# Altium project LeVentilateur.PrjPcb (part 1 of 4)
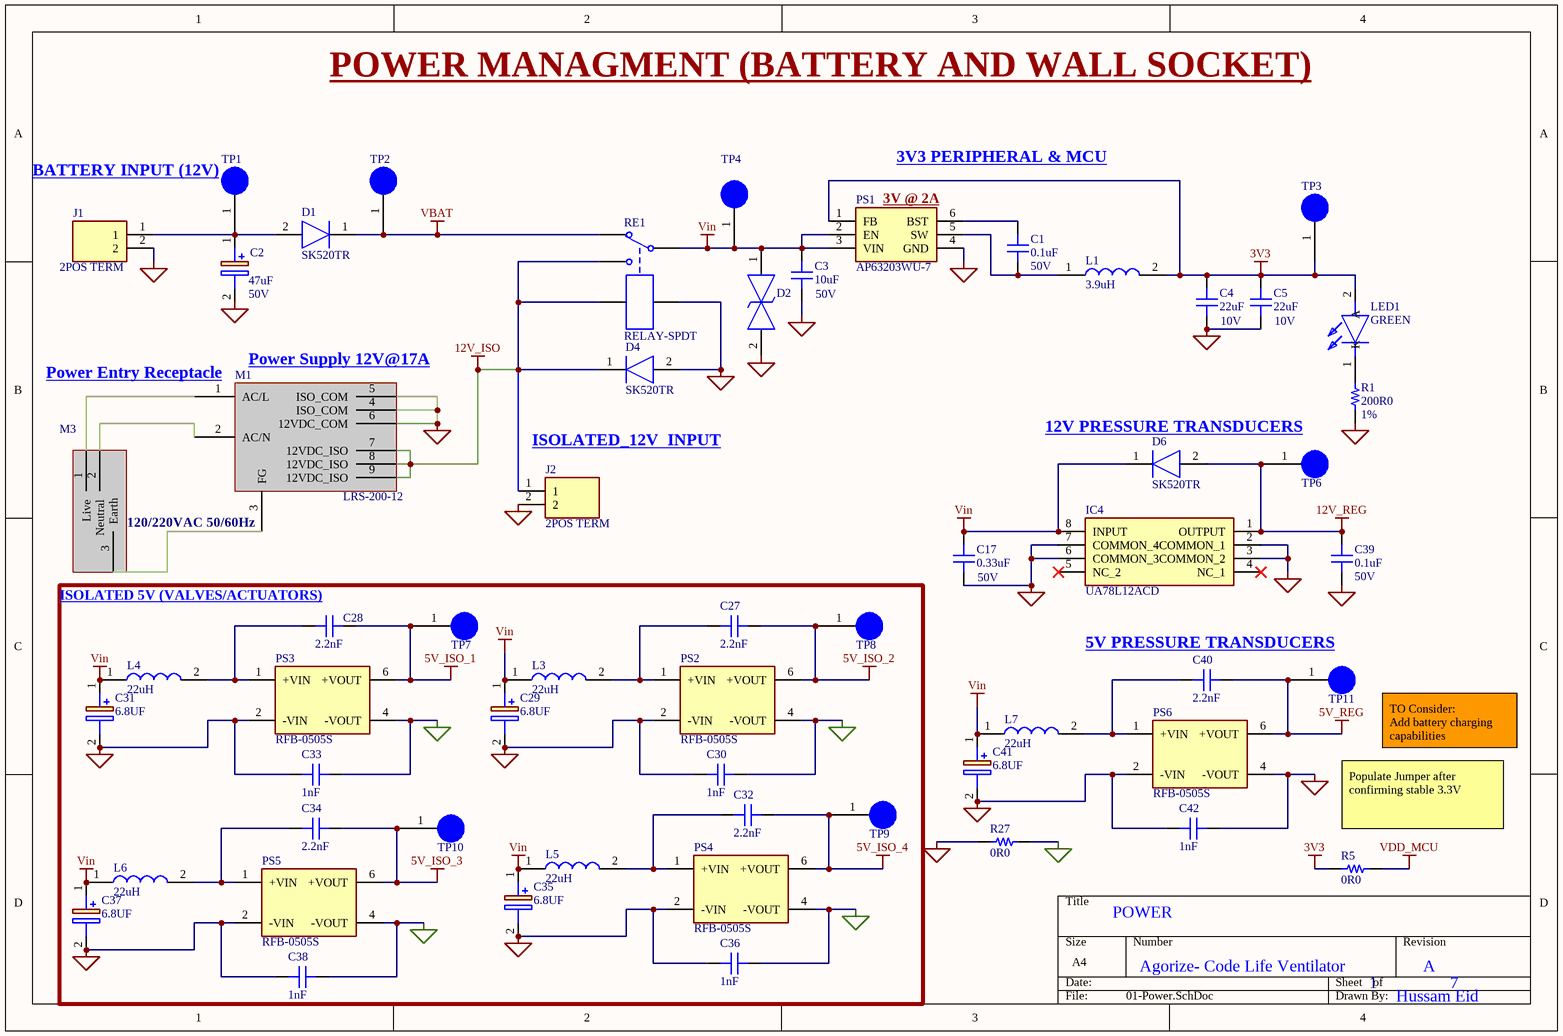
[diagram p0: 01-Power.SchDoc]
Drawn By:: Hussam Eid
7 sheets, 215 parts. Net scope: flat (ports and power ports of the same name join across sheets).
Board file: LeVentilateur.PcbDoc
Sheets:
  01-Power.SchDoc
  02-MCU.SchDoc
  03-Actuators.SchDoc
  04-Sensors.SchDoc
  05-Alarm.SchDoc
  06-User Interface.SchDoc
  07-Mechanicals.SchDoc

## Sheet 01-Power.SchDoc
size A4

### Parts
C1  0.1uF  Voltage Rating: 50V  [CAP 0603/1608]
C2  47uF  Voltage Rating: 50V  [EEE1HA470XP]
C3  10uF  Voltage Rating: 50V  [CAP 1206/3216]
C4  22uF  Voltage: 10V  [RES 0805/2012]
C5  22uF  Voltage: 10V  [RES 0805/2012]
C17  0.33uF  Voltage Rating: 50V  [CAP 0603/1608]
C27  2.2nF  [CAP 0603/1608]
C28  2.2nF  [CAP 0603/1608]
C29  6.8UF  [CAPAE430X550N]
C30  1nF  [CAP 0603/1608]
C31  6.8UF  [CAPAE430X550N]
C32  2.2nF  [CAP 0603/1608]
C33  1nF  [CAP 0603/1608]
C34  2.2nF  [CAP 0603/1608]
C35  6.8UF  [CAPAE430X550N]
C36  1nF  [CAP 0603/1608]
C37  6.8UF  [CAPAE430X550N]
C38  1nF  [CAP 0603/1608]
C39  0.1uF  Voltage Rating: 50V  [CAP 0603/1608]
C40  2.2nF  [CAP 0603/1608]
C41  6.8UF  [CAPAE430X550N]
C42  1nF  [CAP 0603/1608]
D1  SK520TR  [DIOM8060X295N]
D2  DF2B26M4SL,L3F  [TVS]  (value not drawn)
D4  SK520TR  [DIOM8060X295N]
D6  SK520TR  [DIOM8060X295N]
IC4  UA78L12ACD  [SOIC127P600X175-8N]
J1  2POS TERM  [SHDR2W110P0X500_1X2_1000X830X1140P]
J2  2POS TERM  [SHDR2W110P0X500_1X2_1000X830X1140P]
L1  3.9uH  [1255AY100MP3]
L3  22uH  [1255AY100MP3]
L4  22uH  [1255AY100MP3]
L5  22uH  [1255AY100MP3]
L6  22uH  [1255AY100MP3]
L7  22uH  [1255AY100MP3]
LED1  GREEN  [150060GS73220]
M1  Manufacturer Part Number 1: LRS-200-12  (hidden comment: 12V 204W PS)  (mechanical)
M3  Power Entry Receptacle  (mechanical)
PS1  AP63203WU-7  [SOT95P280X100-6N]
PS2  RFB-0505S  [RFB0505S]
PS3  RFB-0505S  [RFB0505S]
PS4  RFB-0505S  [RFB0505S]
PS5  RFB-0505S  [RFB0505S]
PS6  RFB-0505S  [RFB0505S]
R1  200R0  Tolerance: 1%  [RES 1206/3216]
R5  0R0  [RES 0603/1608]
R27  0R0  [RES 0603/1608]
RE1  RELAY-SPDT  [T9GV5L145]
TP1  TP  [TP]  (value not drawn)
TP2  TP  [TP]  (value not drawn)
TP3  TP  [TP]  (value not drawn)
TP4  TP  [TP]  (value not drawn)
TP6  TP  [TP]  (value not drawn)
TP7  TP  [TP]  (value not drawn)
TP8  TP  [TP]  (value not drawn)
TP9  TP  [TP]  (value not drawn)
TP10  TP  [TP]  (value not drawn)
TP11  TP  [TP]  (value not drawn)

### Nets
3V3: C4.2 C5.2 L1.2 LED1.2(A) PS1.1(FB) R5.1 TP3.1
5V_ISO_1: C28.2 PS3.6(+VOUT) TP7.1
5V_ISO_2: C27.2 PS2.6(+VOUT) TP8.1
5V_ISO_3: C34.2 PS5.6(+VOUT) TP10.1
5V_ISO_4: C32.2 PS4.6(+VOUT) TP9.1
5V_REG: C40.2 PS6.6(+VOUT) TP11.1
12V_ISO: D4.1(K) J2.1 M1.7(12VDC_ISO) M1.8(12VDC_ISO) M1.9(12VDC_ISO) RE1.3 RE1.4
12V_REG: C39.1 D6.2(A) IC4.1(OUTPUT) TP6.1
COM: C2.2(-) C3.1 C4.1 C5.1 C17.2 C29.2(-) C30.1 C31.2(-) C33.1 C35.2(-) C36.1 C37.2(-) C38.1 C39.2 C41.2(-) C42.1 C42.2 D2.2 D4.2(A) IC4.2(COMMON_1) IC4.3(COMMON_2) IC4.6(COMMON_3) IC4.7(COMMON_4) J1.2 J2.2 M1.4(ISO_COM) M1.5(ISO_COM) M1.6(12VDC_COM) PS1.4(GND) PS2.2(-VIN) PS3.2(-VIN) PS4.2(-VIN) PS5.2(-VIN) PS6.2(-VIN) PS6.4(-VOUT) R1.1 R27.1 RE1.2
COM_ISO: C30.2 C33.2 C36.2 C38.2 PS2.4(-VOUT) PS3.4(-VOUT) PS4.4(-VOUT) PS5.4(-VOUT) R27.2
VBAT: D1.1(K) RE1.5 TP2.1
VDD_MCU: R5.2
Vin: C3.2 C17.1 C29.1(+) C31.1(+) C35.1(+) C37.1(+) C41.1(+) D2.1 D6.1(K) IC4.8(INPUT) L3.1 L4.1 L5.1 L6.1 L7.1 PS1.2(EN) PS1.3(VIN) RE1.1 TP4.1
NetC1_1: C1.1 PS1.6(BST)
NetC1_2: C1.2 L1.1 PS1.5(SW)
NetC2_1: C2.1(+) D1.2(A) J1.1 TP1.1
NetC27_1: C27.1 L3.2 PS2.1(+VIN)
NetC28_1: C28.1 L4.2 PS3.1(+VIN)
NetC32_1: C32.1 L5.2 PS4.1(+VIN)
NetC34_1: C34.1 L6.2 PS5.1(+VIN)
NetC40_1: C40.1 L7.2 PS6.1(+VIN)
NetLED1_1: LED1.1(K) R1.2
NetM1_1: M1.1(AC/L) M3.1(Live)
NetM1_2: M1.2(AC/N) M3.2(Neutral)
NetM1_3: M1.3(FG) M3.3(Earth)

Not connected (* = marked no-connect by the designer): IC4 4(NC_1)* 5(NC_2)*

### Notes on the sheet
- POWER MANAGMENT (BATTERY AND WALL SOCKET)
- BATTERY INPUT (12V)
- 3V3 PERIPHERAL & MCU
- (near PS1) 3V @ 2A
- (near M1) Power Supply 12V@17A
- ISOLATED_12V  INPUT
- (near D6) 12V PRESSURE TRANSDUCERS
- (near M3) 120/220VAC 50/60Hz
- (near C40) 5V PRESSURE TRANSDUCERS
- TO Consider:
  Add battery charging capabilities
- (near R5) Populate Jumper after confirming stable 3.3V
- POWER
- Agorize- Code Life Ventilator
- 1
- A
- 7
- ISOLATED 5V (VALVES/ACTUATORS)
- Hussam Eid

### Library data of the parts
C1 C39 = C1608X7R1E104K080AA: CAP CER 0.1UF 50V X7R 0603; Manufacturer 1: KEMET; Manufacturer Part Number 1: C0603C104M5RACTU; Description 1: Cap Ceramic 0.1uF 50V X7R 20% SMD 0603 125C T/R; Dielectric Material: Ceramic; Capacitance: 100nF; Tolerance: 20%; Dissipation Factor: 2.5%; ComponentLink1Description: Datasheet; ComponentLink1URL: https://product.tdk.com/info/en/catalog/datasheets/mlcc_commercial_general_en.pdf; ComponentLink2Description: Digi-Key listing; ComponentLink2URL: http://digikey.com/product-detail/en/C1608X7R1E104K080AA/445-1316-1-ND/567697; Supplier 1: Digi-Key; Supplier Part Number 1: 399-7845-1-ND; RoHS 1: Yes; Stock 1: 3475152; Pricing 1: 1 = 0.10000, 10 = 0.03900, 100 = 0.01740, 500 = 0.01240, 1000 = 0.00974 (USD); Mount: Surface Mount,PCB; Case/Package: 0603; Contact Plating: Tin,Matte; Case Code (Metric): 1608; Case Code (Imperial): 0603; Min Operating Temperature: -55°C; Max Operating Temperature: 125°C; Dielectric: X7R; Termination: SMD/SMT; Package Quantity: 1; Packaging: Tape and Reel; Voltage Rating (DC): 50V; Length: 1.6mm; Height: 0.8mm; Thickness: 0.034inch; Lead Pitch: 0.7mm; Depth: 0.8mm; Width: 0.031inch; Radiation Hardening: No; REACH SVHC: No SVHC; ComponentLink3URL: https://www.verical.com/server-webapp/html/getDatasheet?partID=626892&src-supplier=Verical; ComponentLink3Description: https://www.verical.com/server-webapp/html/getDatasheet?partID=626892&src-supplier=Verical; ComponentLink4URL: http://www.farnell.com/datasheets/2746056.pdf?src-supplier=Farnell; ComponentLink4Description: http://www.farnell.com/datasheets/2746056.pdf?src-supplier=Farnell; ComponentLink5URL: http://components.arrow.com/part/dataview/0323_00313986?src-supplier=Arrow+Europe; ComponentLink5Description: http://components.arrow.com/part/dataview/0323_00313986?src-supplier=Arrow+Europe; ComponentLink6URL: http://www.mouser.com/ds/2/212/KEM_C1002_X7R_SMD-1102033.pdf?src-supplier=Mouser; ComponentLink6Description: http://www.mouser.com/ds/2/212/KEM_C1002_X7R_SMD-1102033.pdf?src-supplier=Mouser; ComponentLink7URL: http://www.alliedelec.com/m/d/6f3b5eb83d09db50ed28bdc730567b33.pdf?src-supplier=Allied+Electronics; ComponentLink7Description: http://www.alliedelec.com/m/d/6f3b5eb83d09db50ed28bdc730567b33.pdf?src-supplier=Allied+Electronics; ComponentLink8URL: http://components.arrow.com/part/dataview/40911037S8853915N7429?src-supplier=Arrow; ComponentLink8Description: http://components.arrow.com/part/dataview/40911037S8853915N7429?src-supplier=Arrow; ComponentLink9URL: http://www.farnell.com/datasheets/2746056.pdf?src-supplier=Newark; ComponentLink9Description: http://www.farnell.com/datasheets/2746056.pdf?src-supplier=Newark; ComponentLink10URL: http://www.farnell.com/datasheets/1828800.pdf?src-supplier=Newark; ComponentLink10Description: http://www.farnell.com/datasheets/1828800.pdf?src-supplier=Newark; ComponentLink11URL: http://capacitoredge.kemet.com/capedge2/DataSheet?pn=C0603C104M5RAC7867&src-supplier=Avnet+Asia; ComponentLink11Description: http://capacitoredge.kemet.com/capedge2/DataSheet?pn=C0603C104M5RAC7867&src-supplier=Avnet+Asia; ComponentLink12URL: https://api.kemet.com/component-edge/download/datasheet/C0603C104M5RACTU.pdf?src-supplier=Digi-Key; ComponentLink12Description: https://api.kemet.com/component-edge/download/datasheet/C0603C104M5RACTU.pdf?src-supplier=Digi-Key; ComponentLink13URL: https://www.verical.com/server-webapp/html/getDatasheet?partID=110138&src-supplier=Verical; ComponentLink13Description: https://www.verical.com/server-webapp/html/getDatasheet?partID=110138&src-supplier=Verical; ComponentLink14URL: http://capacitoredge.kemet.com/capedge2/DataSheet?pn=C0603C104M5RAC7867&src-supplier=Avnet; ComponentLink14Description: http://capacitoredge.kemet.com/capedge2/DataSheet?pn=C0603C104M5RAC7867&src-supplier=Avnet; ComponentLink15URL: http://www.farnell.com/datasheets/2315113.pdf?src-supplier=Newark; ComponentLink15Description: http://www.farnell.com/datasheets/2315113.pdf?src-supplier=Newark; ComponentLink16URL: http://www.farnell.com/datasheets/2746056.pdf?src-supplier=Element14; ComponentLink16Description: http://www.farnell.com/datasheets/2746056.pdf?src-supplier=Element14
C2 = EEE-1HA470XP: CAP ALUM 47UF 20% 50V SMD; Manufacturer 1: Panasonic; Manufacturer Part Number 1: EEE-1HA470XAP; Ripple Current: 105mA; Life (Hours): 2000Hour; Dissipation Factor: 0.14%; Leakage Current: 3uA; Lead Diameter: 0.65mm; Supplier 1: Digi-Key; Supplier Part Number 1: PCE4622CT-ND; RoHS 1: Yes; Description 1: CAP ALUM 47UF 20% 50V SMD; Stock 1: 1561; Pricing 1: 1 = 0.43000, 10 = 0.30600, 100 = 0.20180 (USD); Mount: Surface Mount,PCB; Case/Package: Radial; Number of Pins: 8; Min Operating Temperature: -40°C; Max Operating Temperature: 85°C; Capacitance: 47uF; Tolerance: 20%; Packaging: Tape and Reel; Package Quantity: 1; Voltage Rating (DC): 50V; Termination: SMD/SMT; Voltage: 50V; Diameter: 6.3mm; Length: 8mm; Height: 7.8mm; Height - Seated (Max): 0.303inch; Lead Pitch: 1.8mm; Radiation Hardening: No; Lead Free: Lead Free; ComponentLink1URL: https://datasheet.ciiva.com/2985/aba0000ce115-2985177.pdf?src-supplier=Avnet; ComponentLink1Description: https://datasheet.ciiva.com/2985/aba0000ce115-2985177.pdf?src-supplier=Avnet; ComponentLink2URL: https://datasheet.ciiva.com/17535/aba0000ce115-17535690.pdf?src-supplier=Avnet+Europe; ComponentLink2Description: https://datasheet.ciiva.com/17535/aba0000ce115-17535690.pdf?src-supplier=Avnet+Europe; ComponentLink3URL: https://datasheet.ciiva.com/14605/70255709-14605342.pdf?src-supplier=Allied+Electronics; ComponentLink3Description: https://datasheet.ciiva.com/14605/70255709-14605342.pdf?src-supplier=Allied+Electronics; ComponentLink4URL: https://datasheet.ciiva.com/30171/aba0000ce115-30171439.pdf?src-supplier=Onlinecomponents.com; ComponentLink4Description: https://datasheet.ciiva.com/30171/aba0000ce115-30171439.pdf?src-supplier=Onlinecomponents.com; ComponentLink5URL: https://datasheet.ciiva.com/2985/aba0000ce115-2985176.pdf?src-supplier=Avnet; ComponentLink5Description: https://datasheet.ciiva.com/2985/aba0000ce115-2985176.pdf?src-supplier=Avnet
C3 = C1206C105M3RACTU: CAP CER 10UF 25V X7R 1206; Manufacturer 1: Samsung; Manufacturer Part Number 1: CL31A106MBHNNNE; Description 1: CAP CER 10UF 50V X5R 1206; Dielectric: X5R; Tolerance: 20%; ComponentLink1Description: Datasheet; ComponentLink1URL: http://www.kemet.com/docfinder?Partnumber=C1206C105M3RACTU; ComponentLink2Description: Digi-Key listing; ComponentLink2URL: http://digikey.com/product-detail/en/C1206C105M3RACTU/399-8148-2-ND/2215101; Supplier 1: Digi-Key; Supplier Part Number 1: 1276-6736-1-ND; RoHS 1: Yes; Stock 1: 854671; Pricing 1: 1 = 0.34000, 10 = 0.23000, 100 = 0.13040, 500 = 0.09206, 1000 = 0.08055 (USD); Mount: Surface Mount; Case/Package: 1206; Case Code (Imperial): 1206; Case Code (Metric): 3216; Min Operating Temperature: -55°C; Max Operating Temperature: 85°C; Voltage Rating (DC): 50V; Packaging: Tape and Reel; Capacitance: 10uF; Length: 0.126inch; Width: 0.063inch; Thickness: 0.071inch; ComponentLink3URL: http://www.samsungsem.com/kr/support/product-search/mlcc/CL31A106MBHNNNE.jsp?src-supplier=Digi-Key; ComponentLink3Description: http://www.samsungsem.com/kr/support/product-search/mlcc/CL31A106MBHNNNE.jsp?src-supplier=Digi-Key
C4 C5 = C2012X7R1H104K085AA: CAP CER 22UF 10V X5R 0805; Manufacturer 1: Taiyo Yuden; Manufacturer Part Number 1: LMK212BBJ226MG-T; Description 1: CAP ,MLCC ,0805,10V,X5R,22 F 20% ,T&R; Tolerance: 20%; ComponentLink1Description: Datasheet; ComponentLink1URL: https://product.tdk.com/info/en/catalog/datasheets/mlcc_commercial_general_en.pdf; ComponentLink2Description: Digi-Key listing; ComponentLink2URL: http://digikey.com/product-detail/en/C2012X7R1H104K085AA/445-7534-2-ND/2732969; ComponentLink3URL: https://datasheet.ciiva.com/25796/cl21a226mqqnnne-25796195.pdf?src-supplier=Digi-Key; ComponentLink3Description: https://datasheet.ciiva.com/25796/cl21a226mqqnnne-25796195.pdf?src-supplier=Digi-Key; ComponentLink4URL: https://datasheet.ciiva.com/26838/getdatasheetpartid-357607-26838611.pdf?src-supplier=Verical; ComponentLink4Description: https://datasheet.ciiva.com/26838/getdatasheetpartid-357607-26838611.pdf?src-supplier=Verical; ComponentLink5URL: https://datasheet.ciiva.com/16361/cl21a226mqqnnne-16361189.pdf?src-supplier=Future+Electronics; ComponentLink5Description: https://datasheet.ciiva.com/16361/cl21a226mqqnnne-16361189.pdf?src-supplier=Future+Electronics; ComponentLink6URL: https://datasheet.ciiva.com/26787/cl21a226mqqnnne-26787006.pdf?src-supplier=IIIC; ComponentLink6Description: https://datasheet.ciiva.com/26787/cl21a226mqqnnne-26787006.pdf?src-supplier=IIIC; Supplier 1: Digi-Key; Supplier Part Number 1: 587-5464-1-ND; RoHS 1: Yes; Stock 1: 35; Pricing 1: 1 = 0.30000, 10 = 0.20600, 100 = 0.11660, 500 = 0.08228, 1000 = 0.07200 (USD); Mount: Surface Mount; Case/Package: 0805; Min Operating Temperature: -55°C; Max Operating Temperature: 85°C; Dielectric: X5R; Capacitance: 22uF; Length: 2mm; Height: 1.25mm; Depth: 1.25mm; ComponentLink7URL: http://ds.yuden.co.jp/TYCOMPAS/ut/detail.do?productNo=LMK212BBJ226MG-T&fileName=LMK212BBJ226MG-T_SS&mode=specSheetDownload&src-supplier=Digi-Key; ComponentLink7Description: http://ds.yuden.co.jp/TYCOMPAS/ut/detail.do?productNo=LMK212BBJ226MG-T&fileName=LMK212BBJ226MG-T_SS&mode=specSheetDownload&src-supplier=Digi-Key; ComponentLink8URL: https://ds.yuden.co.jp/TYCOMPAS/ut/detail?pn=LMK212BBJ226MG-T &amp;u=M&src-supplier=Digi-Key; ComponentLink8Description: https://ds.yuden.co.jp/TYCOMPAS/ut/detail?pn=LMK212BBJ226MG-T &amp;u=M&src-supplier=Digi-Key
C17 = C1608X7R1E104K080AA: CAP CER 0.33UF 50V X5R 0603; Manufacturer 1: TDK; Manufacturer Part Number 1: C1608X5R1H334K080AB; Description 1: TDK         C1608X5R1H334K080AB            SMD Multilayer Ceramic Capacitor, C Series, 0.33 F,  10%, X5R, 50 V, 0603 [1608 Metric]; Dielectric Material: Ceramic; Capacitance: 330nF; Tolerance: 10%; ComponentLink1Description: Datasheet; ComponentLink1URL: https://product.tdk.com/info/en/catalog/datasheets/mlcc_commercial_general_en.pdf; ComponentLink2Description: Digi-Key listing; ComponentLink2URL: http://digikey.com/product-detail/en/C1608X7R1E104K080AA/445-1316-1-ND/567697; ComponentLink3URL: https://www.verical.com/server-webapp/html/getDatasheet?partID=626892&src-supplier=Verical; ComponentLink3Description: https://www.verical.com/server-webapp/html/getDatasheet?partID=626892&src-supplier=Verical; ComponentLink4URL: http://www.farnell.com/datasheets/2746056.pdf?src-supplier=Farnell; ComponentLink4Description: http://www.farnell.com/datasheets/2746056.pdf?src-supplier=Farnell; ComponentLink5URL: http://components.arrow.com/part/dataview/0323_00313986?src-supplier=Arrow+Europe; ComponentLink5Description: http://components.arrow.com/part/dataview/0323_00313986?src-supplier=Arrow+Europe; ComponentLink6URL: http://www.mouser.com/ds/2/212/KEM_C1002_X7R_SMD-1102033.pdf?src-supplier=Mouser; ComponentLink6Description: http://www.mouser.com/ds/2/212/KEM_C1002_X7R_SMD-1102033.pdf?src-supplier=Mouser; ComponentLink7URL: http://www.alliedelec.com/m/d/6f3b5eb83d09db50ed28bdc730567b33.pdf?src-supplier=Allied+Electronics; ComponentLink7Description: http://www.alliedelec.com/m/d/6f3b5eb83d09db50ed28bdc730567b33.pdf?src-supplier=Allied+Electronics; ComponentLink8URL: http://components.arrow.com/part/dataview/40911037S8853915N7429?src-supplier=Arrow; ComponentLink8Description: http://components.arrow.com/part/dataview/40911037S8853915N7429?src-supplier=Arrow; ComponentLink9URL: http://www.farnell.com/datasheets/2746056.pdf?src-supplier=Newark; ComponentLink9Description: http://www.farnell.com/datasheets/2746056.pdf?src-supplier=Newark; ComponentLink10URL: http://www.farnell.com/datasheets/1828800.pdf?src-supplier=Newark; ComponentLink10Description: http://www.farnell.com/datasheets/1828800.pdf?src-supplier=Newark; ComponentLink11URL: http://capacitoredge.kemet.com/capedge2/DataSheet?pn=C0603C104M5RAC7867&src-supplier=Avnet+Asia; ComponentLink11Description: http://capacitoredge.kemet.com/capedge2/DataSheet?pn=C0603C104M5RAC7867&src-supplier=Avnet+Asia; ComponentLink12URL: https://api.kemet.com/component-edge/download/datasheet/C0603C104M5RACTU.pdf?src-supplier=Digi-Key; ComponentLink12Description: https://api.kemet.com/component-edge/download/datasheet/C0603C104M5RACTU.pdf?src-supplier=Digi-Key; ComponentLink13URL: https://www.verical.com/server-webapp/html/getDatasheet?partID=110138&src-supplier=Verical; ComponentLink13Description: https://www.verical.com/server-webapp/html/getDatasheet?partID=110138&src-supplier=Verical; ComponentLink14URL: http://capacitoredge.kemet.com/capedge2/DataSheet?pn=C0603C104M5RAC7867&src-supplier=Avnet; ComponentLink14Description: http://capacitoredge.kemet.com/capedge2/DataSheet?pn=C0603C104M5RAC7867&src-supplier=Avnet; ComponentLink15URL: http://www.farnell.com/datasheets/2315113.pdf?src-supplier=Newark; ComponentLink15Description: http://www.farnell.com/datasheets/2315113.pdf?src-supplier=Newark; ComponentLink16URL: http://www.farnell.com/datasheets/2746056.pdf?src-supplier=Element14; ComponentLink16Description: http://www.farnell.com/datasheets/2746056.pdf?src-supplier=Element14; Supplier 1: Digi-Key; Supplier Part Number 1: 445-7462-1-ND; RoHS 1: Yes; Stock 1: 12717; Pricing 1: 1 = 0.23000, 10 = 0.15700, 100 = 0.07930, 500 = 0.05428, 1000 = 0.04802 (USD); Mount: Surface Mount; Case/Package: 0603; Number of Pins: 2; Weight: 7.1E-05oz; Case Code (Metric): 1608; Case Code (Imperial): 0603; Min Operating Temperature: -55°C; Max Operating Temperature: 85°C; Termination: SMD/SMT; Packaging: Tape and Reel; Voltage Rating (DC): 50V; Dielectric: X5R; Composition: Ceramic; Package Quantity: 1; Length: 1.6mm; Height: 0.8mm; Width: 0.031inch; Thickness: 0.035inch; Depth: 0.8mm; Radiation Hardening: No; REACH SVHC: No SVHC; Lead Free: Lead Free; ComponentLink17URL: https://datasheet.ciiva.com/26919/getdatasheetpartid-755505-26919191.pdf?src-supplier=Verical; ComponentLink17Description: https://datasheet.ciiva.com/26919/getdatasheetpartid-755505-26919191.pdf?src-supplier=Verical; ComponentLink18URL: https://datasheet.ciiva.com/6251/tdkmlcccaprange-6251126.pdf?src-supplier=Digi-Key; ComponentLink18Description: https://datasheet.ciiva.com/6251/tdkmlcccaprange-6251126.pdf?src-supplier=Digi-Key; ComponentLink19URL: https://datasheet.ciiva.com/22694/1796654-22694123.pdf?src-supplier=Element14; ComponentLink19Description: https://datasheet.ciiva.com/22694/1796654-22694123.pdf?src-supplier=Element14; ComponentLink20URL: https://datasheet.ciiva.com/7975/1796654-7975053.pdf?src-supplier=Element14; ComponentLink20Description: https://datasheet.ciiva.com/7975/1796654-7975053.pdf?src-supplier=Element14
C27 C28 C32 C34 C40 = C1608X7R1E104K080AA: CAP CER 2.2nF 50V X7R 0603; Manufacturer 1: KEMET; Manufacturer Part Number 1: C0603C104M5RACTU; Description 1: Cap Ceramic 0.1uF 50V X7R 20% SMD 0603 125C T/R; Dielectric Material: Ceramic; Capacitance: 100nF; Tolerance: 20%; Dissipation Factor: 2.5%; ComponentLink1Description: Datasheet; ComponentLink1URL: https://product.tdk.com/info/en/catalog/datasheets/mlcc_commercial_general_en.pdf; ComponentLink2Description: Digi-Key listing; ComponentLink2URL: http://digikey.com/product-detail/en/C1608X7R1E104K080AA/445-1316-1-ND/567697; ComponentLink3URL: https://www.verical.com/server-webapp/html/getDatasheet?partID=626892&src-supplier=Verical; ComponentLink3Description: https://www.verical.com/server-webapp/html/getDatasheet?partID=626892&src-supplier=Verical; ComponentLink4URL: http://www.farnell.com/datasheets/2746056.pdf?src-supplier=Farnell; ComponentLink4Description: http://www.farnell.com/datasheets/2746056.pdf?src-supplier=Farnell; ComponentLink5URL: http://components.arrow.com/part/dataview/0323_00313986?src-supplier=Arrow+Europe; ComponentLink5Description: http://components.arrow.com/part/dataview/0323_00313986?src-supplier=Arrow+Europe; ComponentLink6URL: http://www.mouser.com/ds/2/212/KEM_C1002_X7R_SMD-1102033.pdf?src-supplier=Mouser; ComponentLink6Description: http://www.mouser.com/ds/2/212/KEM_C1002_X7R_SMD-1102033.pdf?src-supplier=Mouser; ComponentLink7URL: http://www.alliedelec.com/m/d/6f3b5eb83d09db50ed28bdc730567b33.pdf?src-supplier=Allied+Electronics; ComponentLink7Description: http://www.alliedelec.com/m/d/6f3b5eb83d09db50ed28bdc730567b33.pdf?src-supplier=Allied+Electronics; ComponentLink8URL: http://components.arrow.com/part/dataview/40911037S8853915N7429?src-supplier=Arrow; ComponentLink8Description: http://components.arrow.com/part/dataview/40911037S8853915N7429?src-supplier=Arrow; ComponentLink9URL: http://www.farnell.com/datasheets/2746056.pdf?src-supplier=Newark; ComponentLink9Description: http://www.farnell.com/datasheets/2746056.pdf?src-supplier=Newark; ComponentLink10URL: http://www.farnell.com/datasheets/1828800.pdf?src-supplier=Newark; ComponentLink10Description: http://www.farnell.com/datasheets/1828800.pdf?src-supplier=Newark; ComponentLink11URL: http://capacitoredge.kemet.com/capedge2/DataSheet?pn=C0603C104M5RAC7867&src-supplier=Avnet+Asia; ComponentLink11Description: http://capacitoredge.kemet.com/capedge2/DataSheet?pn=C0603C104M5RAC7867&src-supplier=Avnet+Asia; ComponentLink12URL: https://api.kemet.com/component-edge/download/datasheet/C0603C104M5RACTU.pdf?src-supplier=Digi-Key; ComponentLink12Description: https://api.kemet.com/component-edge/download/datasheet/C0603C104M5RACTU.pdf?src-supplier=Digi-Key; ComponentLink13URL: https://www.verical.com/server-webapp/html/getDatasheet?partID=110138&src-supplier=Verical; ComponentLink13Description: https://www.verical.com/server-webapp/html/getDatasheet?partID=110138&src-supplier=Verical; ComponentLink14URL: http://capacitoredge.kemet.com/capedge2/DataSheet?pn=C0603C104M5RAC7867&src-supplier=Avnet; ComponentLink14Description: http://capacitoredge.kemet.com/capedge2/DataSheet?pn=C0603C104M5RAC7867&src-supplier=Avnet; ComponentLink15URL: http://www.farnell.com/datasheets/2315113.pdf?src-supplier=Newark; ComponentLink15Description: http://www.farnell.com/datasheets/2315113.pdf?src-supplier=Newark; ComponentLink16URL: http://www.farnell.com/datasheets/2746056.pdf?src-supplier=Element14; ComponentLink16Description: http://www.farnell.com/datasheets/2746056.pdf?src-supplier=Element14; Supplier 1: Digi-Key; Supplier Part Number 1: 399-7845-1-ND; RoHS 1: Yes; Stock 1: 3158249; Pricing 1: 1 = 0.10000, 10 = 0.03900, 100 = 0.01740, 500 = 0.01240, 1000 = 0.00974 (USD); Mount: Surface Mount,PCB; Case/Package: 0603; Contact Plating: Tin,Matte; Case Code (Metric): 1608; Case Code (Imperial): 0603; Min Operating Temperature: -55°C; Max Operating Temperature: 125°C; Dielectric: X7R; Termination: SMD/SMT; Package Quantity: 1; Voltage Rating: 50V; Packaging: Tape and Reel; Voltage Rating (DC): 50V; Length: 1.6mm; Height: 0.8mm; Thickness: 0.034inch; Lead Pitch: 0.7mm; Depth: 0.8mm; Width: 0.031inch; Radiation Hardening: No; REACH SVHC: No SVHC
C29 C31 C35 C37 C41 = CAP_ELECTROLYTIC: CAP 6.8 UF 20% 50 V; Manufacturer 1: Wurth Electronics; Manufacturer Part Number 1: 865080642005; Material: Aluminium; Voltage Rating: 50V; Polarity: Polar; Ripple Current: 75mA; Impedance: 3.8R; Life (Hours): 2000Hour; Supplier 1: Digi-Key; Supplier Part Number 1: 732-8450-1-ND; RoHS 1: Yes; Description 1: CAP 6.8 UF 20% 50 V; Stock 1: 76; Pricing 1: 1 = 0.20000, 50 = 0.17000, 100 = 0.14800, 250 = 0.13200, 500 = 0.11500 (USD); Mount: Surface Mount; Case/Package: Radial; Min Operating Temperature: -55°C; Max Operating Temperature: 105°C; Capacitance: 6.8uF; Tolerance: 20%; Package Quantity: 1000; Packaging: Cut Tape; Ripple Current (AC): 75mA; Voltage Rating (DC): 50V; Diameter: 5mm; Height: 5.5mm; Height - Seated (Max): 0.217inch; REACH SVHC: Unknown; ComponentLink1URL: https://datasheet.ciiva.com/48693/001280473-da-01-en-wcap-asli-alu-elec-caps-865080642005-48693548.pdf?src-supplier=Conrad; ComponentLink1Description: https://datasheet.ciiva.com/48693/001280473-da-01-en-wcap-asli-alu-elec-caps-865080642005-48693548.pdf?src-supplier=Conrad
C30 C33 C36 C38 C42 = C1608X7R1E104K080AA: CAP CER 1nF 50V X7R 0603; Manufacturer 1: KEMET; Manufacturer Part Number 1: C0603C104M5RACTU; Description 1: Cap Ceramic 0.1uF 50V X7R 20% SMD 0603 125C T/R; Capacitance: 100nF; Dielectric Material: Ceramic; Tolerance: 20%; Dissipation Factor: 2.5%; ComponentLink1Description: Datasheet; ComponentLink1URL: https://product.tdk.com/info/en/catalog/datasheets/mlcc_commercial_general_en.pdf; ComponentLink2Description: Digi-Key listing; ComponentLink2URL: http://digikey.com/product-detail/en/C1608X7R1E104K080AA/445-1316-1-ND/567697; Case/Package: 0603; Contact Plating: Tin,Matte; Case Code (Metric): 1608; Case Code (Imperial): 0603; Depth: 0.8mm; ComponentLink3URL: https://www.verical.com/server-webapp/html/getDatasheet?partID=626892&src-supplier=Verical; ComponentLink3Description: https://www.verical.com/server-webapp/html/getDatasheet?partID=626892&src-supplier=Verical; ComponentLink4URL: http://www.farnell.com/datasheets/2746056.pdf?src-supplier=Farnell; ComponentLink4Description: http://www.farnell.com/datasheets/2746056.pdf?src-supplier=Farnell; ComponentLink5URL: http://components.arrow.com/part/dataview/0323_00313986?src-supplier=Arrow+Europe; ComponentLink5Description: http://components.arrow.com/part/dataview/0323_00313986?src-supplier=Arrow+Europe; ComponentLink6URL: http://www.mouser.com/ds/2/212/KEM_C1002_X7R_SMD-1102033.pdf?src-supplier=Mouser; ComponentLink6Description: http://www.mouser.com/ds/2/212/KEM_C1002_X7R_SMD-1102033.pdf?src-supplier=Mouser; ComponentLink7URL: http://www.alliedelec.com/m/d/6f3b5eb83d09db50ed28bdc730567b33.pdf?src-supplier=Allied+Electronics; ComponentLink7Description: http://www.alliedelec.com/m/d/6f3b5eb83d09db50ed28bdc730567b33.pdf?src-supplier=Allied+Electronics; ComponentLink8URL: http://components.arrow.com/part/dataview/40911037S8853915N7429?src-supplier=Arrow; ComponentLink8Description: http://components.arrow.com/part/dataview/40911037S8853915N7429?src-supplier=Arrow; ComponentLink9URL: http://www.farnell.com/datasheets/2746056.pdf?src-supplier=Newark; ComponentLink9Description: http://www.farnell.com/datasheets/2746056.pdf?src-supplier=Newark; ComponentLink10URL: http://www.farnell.com/datasheets/1828800.pdf?src-supplier=Newark; ComponentLink10Description: http://www.farnell.com/datasheets/1828800.pdf?src-supplier=Newark; ComponentLink11URL: http://capacitoredge.kemet.com/capedge2/DataSheet?pn=C0603C104M5RAC7867&src-supplier=Avnet+Asia; ComponentLink11Description: http://capacitoredge.kemet.com/capedge2/DataSheet?pn=C0603C104M5RAC7867&src-supplier=Avnet+Asia; ComponentLink12URL: https://api.kemet.com/component-edge/download/datasheet/C0603C104M5RACTU.pdf?src-supplier=Digi-Key; ComponentLink12Description: https://api.kemet.com/component-edge/download/datasheet/C0603C104M5RACTU.pdf?src-supplier=Digi-Key; ComponentLink13URL: https://www.verical.com/server-webapp/html/getDatasheet?partID=110138&src-supplier=Verical; ComponentLink13Description: https://www.verical.com/server-webapp/html/getDatasheet?partID=110138&src-supplier=Verical; ComponentLink14URL: http://capacitoredge.kemet.com/capedge2/DataSheet?pn=C0603C104M5RAC7867&src-supplier=Avnet; ComponentLink14Description: http://capacitoredge.kemet.com/capedge2/DataSheet?pn=C0603C104M5RAC7867&src-supplier=Avnet; ComponentLink15URL: http://www.farnell.com/datasheets/2315113.pdf?src-supplier=Newark; ComponentLink15Description: http://www.farnell.com/datasheets/2315113.pdf?src-supplier=Newark; ComponentLink16URL: http://www.farnell.com/datasheets/2746056.pdf?src-supplier=Element14; ComponentLink16Description: http://www.farnell.com/datasheets/2746056.pdf?src-supplier=Element14; Parameter 1: *; Supplier 1: Digi-Key; Supplier Part Number 1: 399-7845-1-ND; RoHS 1: Yes; Stock 1: 3158249; Pricing 1: 1 = 0.10000, 10 = 0.03900, 100 = 0.01740, 500 = 0.01240, 1000 = 0.00974 (USD); Mount: Surface Mount,PCB; Min Operating Temperature: -55°C; Max Operating Temperature: 125°C; Dielectric: X7R; Termination: SMD/SMT; Package Quantity: 1; Voltage Rating: 50V; Packaging: Tape and Reel; Voltage Rating (DC): 50V; Length: 1.6mm; Height: 0.8mm; Thickness: 0.034inch; Lead Pitch: 0.7mm; Width: 0.031inch; Radiation Hardening: No; REACH SVHC: No SVHC
D1 D4 D6 = SK520TR: DIODE SCHOTTKY 200V 5A SMC; Supplier 1: Digi-Key; Supplier Part Number 1: 1655-1603-1-ND; Manufacturer 1: SMC; Manufacturer Part Number 1: SK520TR; RoHS 1: No; Description 1: DIODE SCHOTTKY 200V 5A SMC; Stock 1: 19874; Pricing 1: 1 = 0.35000, 10 = 0.28500, 25 = 0.26040, 100 = 0.16360, 250 = 0.16176, 500 = 0.15148, 1000 = 0.10300 (USD); Mount: Surface Mount; Case/Package: SMC; Packaging: Tape and Reel; Max Reverse Voltage (DC): 200V; Average Rectified Current: 5A; ComponentLink1URL: http://www.smc-diodes.com/propdf/SK520%20N0107%20REV.A.pdf?src-supplier=Digi-Key; ComponentLink1Description: http://www.smc-diodes.com/propdf/SK520%20N0107%20REV.A.pdf?src-supplier=Digi-Key
D2 = 1KSMB12CA: BI-DIRECTIONAL ESD PROTECTION DI; Manufacturer 1: Toshiba Semiconductor and Storage; Manufacturer Part Number 1: DF2B26M4SL,L3F
IC4 = UA78L12ACD: Linear Voltage Regulator IC  1 Output  100mA 8-SOIC; Manufacturer 1: Texas Instruments; Datasheet Link: http://www.ti.com/lit/ds/symlink/ua78l12a.pdf; Height: 1.75mm; Manufacturer_Part_Number: UA78L12ACD; Mouser Part Number: 595-UA78L12ACD; Mouser Price/Stock: https://www.mouser.com/Search/Refine.aspx?Keyword=595-UA78L12ACD; RS Part Number: 6616727P; RS Price/Stock: http://uk.rs-online.com/web/p/products/6616727P; Manufacturer Part Number 1: UA78L12ACD
J1 J2 = 1935161: TERM BLK 2POS SIDE ENTRY 5MM PCB; Manufacturer 1: Phoenix Contact; Description 1: Conn Terminal Blocks 2 POS 5mm Solder ST Thru-Hole 16A; Connector Type: Screw; Voltage Rating (DC): 320V; Max Current Rating: 16A; Max Supply Voltage: 250V; Current Rating: 17.5A; Number of Poles: 2; Number of Levels: 1; Current: 18A; Voltage: 300V; Wire Gauge (Max): 26AWG; Wire Gauge (Min): 12AWG; Approvals: UL; ComponentLink1URL: https://datasheet.ciiva.com/15169/getdatasheetpartid-177903-15169663.pdf?src-supplier=Verical; ComponentLink1Description: https://datasheet.ciiva.com/15169/getdatasheetpartid-177903-15169663.pdf?src-supplier=Verical; ComponentLink2URL: https://datasheet.ciiva.com/16047/1935161-16047247.pdf?src-supplier=Onlinecomponents.com; ComponentLink2Description: https://datasheet.ciiva.com/16047/1935161-16047247.pdf?src-supplier=Onlinecomponents.com; ComponentLink3URL: https://datasheet.ciiva.com/824/combiconcompact5-0mmseries-824222.pdf?src-supplier=Digi-Key; ComponentLink3Description: https://datasheet.ciiva.com/824/combiconcompact5-0mmseries-824222.pdf?src-supplier=Digi-Key; Supplier 1: Digi-Key; Supplier Part Number 1: 277-1667-ND; Manufacturer Part Number 1: 1935161; RoHS 1: Yes; Stock 1: 32563; Pricing 1: 1 = 0.43000, 10 = 0.41100, 50 = 0.39280, 100 = 0.38200, 250 = 0.35700, 500 = 0.32844, 1000 = 0.30350 (USD); Mount: Through Hole; Number of Pins: 2; Weight: 0.067021oz; Contact Material: Copper,Tin; Insulation Material: Nylon; Housing Material: Polyamide; Housing Color: Green; Color: Green; Material: Nylon; Number of Rows: 1; Voltage Rating: 250V; Package Quantity: 250; Packaging: Bulk; Number of Positions: 2; Number of Positions Per Level: 2; Termination: Solder; Number of Contacts: 2; Number of Circuits: 2; Orientation: Straight; Length: 9mm; Height: 11.3mm; Width: 14.9mm; Pitch: 5mm; Depth: 9mm; Wire/Cable Gauge: 26AWG; Radiation Hardening: No; Flammability Rating: UL94 V-0; Lead Free: Lead Free; REACH SVHC: Unknown
L1 = 1255AY-3R9N=P3: 3.9µH Shielded Wirewound Inductor 4.2A 26.4mOhm Max Nonstandard; Manufacturer 1: Murata; Description 1: FIXED IND; Core Material: Ferrite; Saturation Current: 4.7A; DC Resistance (DCR): 26.4mR; Test Frequency: 100kHz; Tolerance: 30%; Supplier 1: Digi-Key; Supplier Part Number 1: 490-14062-1-ND; Manufacturer Part Number 1: 1255AY-3R9N=P3; RoHS 1: Yes; Stock 1: 385; Pricing 1: 1 = 0.48000, 10 = 0.42300, 100 = 0.30190, 500 = 0.25358 (USD); Mount: Surface Mount; Case/Package: Nonstandard; Min Operating Temperature: -40°C; Max Operating Temperature: 85°C; Packaging: Tape and Reel; Composition: Wirewound; Inductance: 3.9uH; Current Rating: 4.2A; Shielding: Shielded; Length: 0.248inch; Width: 0.248inch; Height - Seated (Max): 0.177inch; ComponentLink1URL: http://www.toko.co.jp/products/pdf/inductors/dg6045c.pdf?src-supplier=Digi-Key; ComponentLink1Description: http://www.toko.co.jp/products/pdf/inductors/dg6045c.pdf?src-supplier=Digi-Key
L3-L7 = 1255AY-3R9N=P3: Inductor Unshielded Wirewound  190mA 4.81Ohm Max 0805 (2012 Metric); Manufacturer 1: Taiyo Yuden; Manufacturer Part Number 1: CBC2012T220M; Description 1: Inductor Power Chip Wirewound 22uH 20% 2.52MHz Ferrite 190mA 4.81Ohm DCR 0805 T/R; Core Material: Ferrite; Tolerance: 20%; Self Resonant Frequency: 16MHz; DC Resistance (DCR): 4.81R; Test Frequency: 2.52MHz; Max DC Current: 170mA; ComponentLink1URL: http://www.toko.co.jp/products/pdf/inductors/dg6045c.pdf?src-supplier=Digi-Key; ComponentLink1Description: http://www.toko.co.jp/products/pdf/inductors/dg6045c.pdf?src-supplier=Digi-Key; Supplier 1: Digi-Key; Supplier Part Number 1: 587-1604-1-ND; RoHS 1: Yes; Stock 1: 8981; Pricing 1: 1 = 0.24000, 10 = 0.21600, 100 = 0.14860, 500 = 0.12702, 1000 = 0.09729 (USD); Mount: Surface Mount; Case/Package: 0805; Number of Pins: 2; Case Code (Imperial): 0805; Case Code (Metric): 2012; Min Operating Temperature: -40°C; Max Operating Temperature: 105°C; Packaging: Tape and Reel; Inductance: 22uH; Termination: SMD/SMT; Package Quantity: 3000; Current Rating: 190mA; Saturation Current: 170mA; Shielding: Unshielded; Composition: Wirewound; Length: 0.079inch; Height: 1.25mm; Width: 0.049inch; Height - Seated (Max): 0.057inch; Lead Free: Exempt; Halogen Free: Halogen Free; ComponentLink2URL: https://datasheet.ciiva.com/8505/cbc2012t220m-ss-8505651.pdf?src-supplier=Avnet; ComponentLink2Description: https://datasheet.ciiva.com/8505/cbc2012t220m-ss-8505651.pdf?src-supplier=Avnet; ComponentLink3URL: https://datasheet.ciiva.com/1040/cbc2012t220m-ss-1040471.pdf?src-supplier=Digi-Key; ComponentLink3Description: https://datasheet.ciiva.com/1040/cbc2012t220m-ss-1040471.pdf?src-supplier=Digi-Key
LED1 = 150060GS73220: LED GREEN CLEAR 0603 SMD; Manufacturer 1: Wurth Electronics; Manufacturer Part Number 1: 150060VS75000; Description 1: WURTH ELEKTRONIK - 150060VS75000 - LED, Grün, Oberflächenmontage, 603, 30 mA, 2 V, 570 nm; Luminous Intensity: 40mcd; Viewing Angle: 140°; Forward Voltage: 2V; Wavelength: 570nm; Lens Style: Clear,Rectangular; Forward Current: 30mA; Test Current: 20mA; Supplier 1: Digi-Key; Supplier Part Number 1: 732-4980-1-ND; RoHS 1: Yes; Stock 1: 29468; Pricing 1: 1 = 0.14000, 50 = 0.13300, 100 = 0.11400, 500 = 0.09900 (USD); Mount: Surface Mount; Case/Package: 0603; Number of Pins: 2; Case Code (Metric): 1608; Case Code (Imperial): 0603; Color: Green; Min Operating Temperature: -40°C; Max Operating Temperature: 85°C; Package Quantity: 1; Packaging: Tape and Reel; Dominant Wavelength: 570nm; Length: 1.6mm; Height: 0.7mm; Width: 0.8mm; REACH SVHC: Unknown; ComponentLink1URL: https://datasheet.ciiva.com/29562/150060vs75000-29562919.pdf?src-supplier=Digi-Key; ComponentLink1Description: https://datasheet.ciiva.com/29562/150060vs75000-29562919.pdf?src-supplier=Digi-Key
M1 = 12V 204W PS: Enclosed AC DC Converters 1 Output 12V    17A 90 ~ 132 VAC, 180 ~ 264 VAC, 240 ~ 370 VDC Input; Manufacturer 1: Mean Well; Description 1: 204W 12V 17A Single Output Switchable Power Supply; Efficiency: 87.5%; Max Output Power: 200W; Number of Outputs: 1; Max Input Current: 4A; Isolation Voltage: 3kV; Approvals: UL; Supplier 1: Digi-Key; Supplier Part Number 1: 1866-3330-ND; RoHS 1: Yes; Stock 1: 186; Pricing 1: 1 = 30.51000, 10 = 28.71700, 25 = 27.81920, 50 = 26.92180 (USD); Mount: Panel; Weight: 1.455lb; Color: Silver; Min Operating Temperature: -25°C; Max Operating Temperature: 70°C; Packaging: Bulk; Package Quantity: 15; Output Current: 17A; Output Power: 204W; Voltage - Output 1: 12V; Current - Output 1: 17A; Length: 215mm; Height: 30mm; Width: 115mm; Lead Free: Lead Free; ComponentLink1URL: https://datasheet.ciiva.com/43509/lrs-200-spec-43509573.pdf?src-supplier=Onlinecomponents.com; ComponentLink1Description: https://datasheet.ciiva.com/43509/lrs-200-spec-43509573.pdf?src-supplier=Onlinecomponents.com; ComponentLink2URL: https://datasheet.ciiva.com/43506/2219727-43506012.pdf?src-supplier=Jameco; ComponentLink2Description: https://datasheet.ciiva.com/43506/2219727-43506012.pdf?src-supplier=Jameco
M3 = Power Entry Receptacle: Power Entry Connector Receptacle, Male Blades IEC 320-C14 Panel Mount, Flange; Manufacturer 1: Schaffner; Manufacturer Part Number 1: FN9222B-1-06; Description 1: PWR ENT RCPT IEC320-C14 PANEL QC; Number of Contacts: 3; Max Voltage Rating (AC): 250V; Number of Ports: 1; Inductance: 12mH; Resistance: 1MR; Current: 1A; Frequency: 400Hz; Capacitance: 100nF; Fuse: No; Ratings: IP40; Approvals: UL,CSA,ENEC,CQC,VDE; Supplier 1: Digi-Key; Supplier Part Number 1: 817-1428-ND; RoHS 1: Yes; Stock 1: 242; Pricing 1: 1 = 5.75000, 10 = 5.52000, 25 = 5.06000, 50 = 4.83000, 100 = 4.60000, 250 = 4.02500, 500 = 3.91000, 1000 = 3.33500, 2500 = 3.10500 (USD); Mount: Panel,Flanges,Screw; Case/Package: Module; Min Operating Temperature: -25°C; Max Operating Temperature: 85°C; Termination: Solder; Orientation: Straight; Gender: Male; Number of Poles: 3; Packaging: Bulk; Connector Type: Receptacle; Number of Positions: 3; Voltage Rating: 250V; Max Current Rating: 1A; Voltage Rating (AC): 250V; Current Rating: 1A; Package Quantity: 60; Height: 48mm; Width: 22.5mm; Depth: 43.9mm; Radiation Hardening: No; REACH SVHC: No SVHC; Flammability Rating: UL94 V-2; ComponentLink1URL: https://datasheet.ciiva.com/14563/70027175-14563477.pdf?src-supplier=Allied+Electronics; ComponentLink1Description: https://datasheet.ciiva.com/14563/70027175-14563477.pdf?src-supplier=Allied+Electronics; ComponentLink2URL: https://datasheet.ciiva.com/4582/-4582696.pdf?src-supplier=Mouser; ComponentLink2Description: https://datasheet.ciiva.com/4582/-4582696.pdf?src-supplier=Mouser; ComponentLink3URL: https://datasheet.ciiva.com/30243/138index-phpid329l0w4-productsproduct70chash7322c530e83bcf7af0b2e347-30243243.pdf?src-supplier=Onlinecomponents.com; ComponentLink3Description: https://datasheet.ciiva.com/30243/138index-phpid329l0w4-productsproduct70chash7322c530e83bcf7af0b2e347-30243243.pdf?src-supplier=Onlinecomponents.com; ComponentLink4URL: https://datasheet.ciiva.com/46431/1851815-46431020.pdf?src-supplier=Element14; ComponentLink4Description: https://datasheet.ciiva.com/46431/1851815-46431020.pdf?src-supplier=Element14; ComponentLink5URL: https://datasheet.ciiva.com/1019/fn+9222-1019406.pdf?src-supplier=Digi-Key; ComponentLink5Description: https://datasheet.ciiva.com/1019/fn+9222-1019406.pdf?src-supplier=Digi-Key
PS1 = AP63203WU-7: IC REG BUCK 3.3V 2A TSOT26; Manufacturer 1: Diodes; Description 1: AP63203 Series 3.3 V 2 A SMT Fixed Low IQ Synchronous Buck - TSOT-26; ComponentLink1URL: http://www.farnell.com/datasheets/2741240.pdf?src-supplier=Farnell; ComponentLink1Description: http://www.farnell.com/datasheets/2741240.pdf?src-supplier=Farnell; ComponentLink2URL: https://api.kemet.com/component-edge/download/datasheet/C0603C104K5RECAUTO.pdf?src-supplier=Digi-Key; ComponentLink2Description: https://api.kemet.com/component-edge/download/datasheet/C0603C104K5RECAUTO.pdf?src-supplier=Digi-Key; ComponentLink3URL: http://www.farnell.com/datasheets/2741240.pdf?src-supplier=Newark; ComponentLink3Description: http://www.farnell.com/datasheets/2741240.pdf?src-supplier=Newark; ComponentLink4URL: http://www.samsungsem.com/kr/support/product-search/mlcc/CL31A106MBHNNNE.jsp?src-supplier=Digi-Key; ComponentLink4Description: http://www.samsungsem.com/kr/support/product-search/mlcc/CL31A106MBHNNNE.jsp?src-supplier=Digi-Key; Supplier 1: Digi-Key; Supplier Part Number 1: AP63203WU-7DICT-ND; Manufacturer Part Number 1: AP63203WU-7; RoHS 1: No; Stock 1: 8615; Pricing 1: 1 = 0.83000, 10 = 0.74500, 25 = 0.70720, 100 = 0.54290, 250 = 0.47976, 500 = 0.45450, 1000 = 0.35350 (USD)
PS2-PS6 = RFB-0505S: DC DC CONVERTER 5V 1W; Manufacturer_Name: RECOM Power; Manufacturer 1: Recom; Description 1: Recom RFB 1W Isolated DC-DC Converter Through Hole, Voltage out 5V dc; Number of Outputs: 1; Max Output Current: 200mA; Isolation Voltage: 1kV; Efficiency: 80%; Datasheet Link: https://componentsearchengine.com/Datasheets/1/RFB-0505S.pdf; Height: 10.7mm; Manufacturer_Part_Number: RFB-0505S; Mouser Part Number: 919-RFB-0505S; Mouser Price/Stock: https://www.mouser.com/Search/Refine.aspx?Keyword=919-RFB-0505S; RS Part Number: 1855539P; RS Price/Stock: http://uk.rs-online.com/web/p/products/1855539P; Supplier 1: Digi-Key; Supplier Part Number 1: 945-3158-ND; RoHS 1: No; Stock 1: 1808; Pricing 1: 1 = 1.54000, 5 = 1.51800, 10 = 1.49600, 25 = 1.45200, 50 = 1.40800, 100 = 1.36400, 250 = 1.32000, 500 = 1.23200 (USD); Mount: Through Hole; Weight: 2.2g; Min Operating Temperature: -40°C; Max Operating Temperature: 85°C; Max Output Voltage: 5V; Packaging: Rail/Tube; Max Input Voltage: 5V; Max Power Dissipation: 1W; Features: SCP; Voltage - Output 1: 5V; Length: 19.6mm; Width: 6mm; ComponentLink1URL: https://www.recom-power.com/pdf/Econoline/RFB.pdf?src-supplier=Digi-Key; ComponentLink1Description: https://www.recom-power.com/pdf/Econoline/RFB.pdf?src-supplier=Digi-Key; Manufacturer Part Number 1: RFB-0505S
R1 = ERJ-8ENF1002V: RES SMD 10K OHM 1% 1/4W 1206; Manufacturer 1: Yageo; Manufacturer Part Number 1: RC1206FR-07200RL; Description 1: Res Thick Film 1206 200 Ohm 1% 0.25W(1/4W) ±100ppm/C Molded SMD Paper T/R; Temperature Coefficient: 100ppm/°C; Resistance: 200R; Voltage Rating (DC): 200V; Power Rating: 250mW; ComponentLink1Description: Datasheet; ComponentLink1URL: http://industrial.panasonic.com/www-cgi/jvcr13pz.cgi?E+PZ+3+AOA0002+ERJ8ENF1002V+7+WW; ComponentLink2Description: Digi-Key listing; ComponentLink2URL: http://digikey.com/product-detail/en/ERJ-8ENF1002V/P10.0KFTR-ND/89059; Supplier 1: Digi-Key; Supplier Part Number 1: 311-200FRCT-ND; RoHS 1: Yes; Stock 1: 2870115; Pricing 1: 1 = 0.10000, 10 = 0.07100, 100 = 0.02910, 1000 = 0.01306, 2500 = 0.01134 (USD); Mount: Surface Mount; Case/Package: 1206; Weight: 0.000571oz; Case Code (Metric): 3216; Case Code (Imperial): 1206; Min Operating Temperature: -55°C; Max Operating Temperature: 155°C; Composition: Thick Film; Packaging: Tape and Reel; Termination: SMD/SMT; Military Standard: Not; Voltage Rating: 200V; Length: 3.1mm; Height: 0.55mm; Width: 1.6mm; Depth: 1.6mm; Lead Free: Lead Free; ComponentLink3URL: https://datasheet.ciiva.com/11808/0900766b80c6630a-11808603.pdf?src-supplier=RSComponents; ComponentLink3Description: https://datasheet.ciiva.com/11808/0900766b80c6630a-11808603.pdf?src-supplier=RSComponents
R5 R27 = ERJ-3EKF1001V: RES SMD 0 OHM JUMPER 1/10W 0603; Manufacturer 1: Panasonic; Manufacturer Part Number 1: ERJ-3GEY0R00V; Description 1: Res Thick Film 0603 0 Ohm Jumper Molded SMD Punched Carrier T/R; Resistance: 0mR; Power Rating: 100mW; Voltage Rating: 75V; Tolerance: 0%; Voltage Rating (DC): 50V; Temperature Coefficient: 600ppm/°C; ComponentLink1Description: Datasheet; ComponentLink1URL: http://industrial.panasonic.com/www-cgi/jvcr13pz.cgi?E+PZ+3+AOA0002+ERJ3EKF1001V+7+WW; ComponentLink2Description: Digi-Key listing; ComponentLink2URL: http://digikey.com/product-detail/en/ERJ-3EKF1001V/P1.00KHTR-ND/196032; Supplier 1: Digi-Key; Supplier Part Number 1: P0.0GDKR-ND; RoHS 1: Yes; Stock 1: 17444338; Pricing 1: 1 = 0.10000, 10 = 0.03800, 25 = 0.02760, 50 = 0.02120, 100 = 0.01560, 250 = 0.01188, 500 = 0.00950, 1000 = 0.00700 (USD); Mount: Surface Mount; Case/Package: 0603; Contact Plating: Tin; Case Code (Metric): 1608; Case Code (Imperial): 0603; Min Operating Temperature: -55°C; Max Operating Temperature: 155°C; Composition: Thick Film; Packaging: Tape and Reel; Package Quantity: 1; Number of Terminations: 2; Termination: SMD/SMT; Military Standard: Not; Features: Automotive AEC-Q200; Max Power Dissipation: 100mW; Length: 1.6mm; Height: 0.45mm; Width: 0.031inch; Depth: 0.8mm; Radiation Hardening: No; Lead Free: Lead Free; REACH SVHC: No SVHC; ComponentLink3URL: https://datasheet.ciiva.com/27055/1935748-27055113.pdf?src-supplier=Jameco; ComponentLink3Description: https://datasheet.ciiva.com/27055/1935748-27055113.pdf?src-supplier=Jameco; ComponentLink4URL: https://datasheet.ciiva.com/11808/0900766b80f806dd-11808207.pdf?src-supplier=RSComponents; ComponentLink4Description: https://datasheet.ciiva.com/11808/0900766b80f806dd-11808207.pdf?src-supplier=RSComponents; ComponentLink5URL: https://datasheet.ciiva.com/48532/aoa0000ce1-48532165.pdf?src-supplier=Avnet; ComponentLink5Description: https://datasheet.ciiva.com/48532/aoa0000ce1-48532165.pdf?src-supplier=Avnet; ComponentLink6URL: https://datasheet.ciiva.com/43460/1678796-43460647.pdf?src-supplier=Farnell; ComponentLink6Description: https://datasheet.ciiva.com/43460/1678796-43460647.pdf?src-supplier=Farnell; ComponentLink7URL: https://datasheet.ciiva.com/28695/1678796-28695833.pdf?src-supplier=Element14; ComponentLink7Description: https://datasheet.ciiva.com/28695/1678796-28695833.pdf?src-supplier=Element14; ComponentLink8URL: https://datasheet.ciiva.com/5959/1678796-5959707.pdf?src-supplier=Farnell; ComponentLink8Description: https://datasheet.ciiva.com/5959/1678796-5959707.pdf?src-supplier=Farnell; ComponentLink9URL: https://datasheet.ciiva.com/46377/1678796-46377868.pdf?src-supplier=Element14; ComponentLink9Description: https://datasheet.ciiva.com/46377/1678796-46377868.pdf?src-supplier=Element14; ComponentLink10URL: https://datasheet.ciiva.com/9198/aoa0000ce1-9198975.pdf?src-supplier=Avnet; ComponentLink10Description: https://datasheet.ciiva.com/9198/aoa0000ce1-9198975.pdf?src-supplier=Avnet; ComponentLink11URL: https://datasheet.ciiva.com/16758/70255313-16758527.pdf?src-supplier=Allied+Electronics; ComponentLink11Description: https://datasheet.ciiva.com/16758/70255313-16758527.pdf?src-supplier=Allied+Electronics; ComponentLink12URL: https://datasheet.ciiva.com/16834/aoa0000ce1-16834828.pdf?src-supplier=Future+Electronics; ComponentLink12Description: https://datasheet.ciiva.com/16834/aoa0000ce1-16834828.pdf?src-supplier=Future+Electronics; ComponentLink13URL: https://datasheet.ciiva.com/17215/aoa0000ce1-17215388.pdf?src-supplier=Avnet+Europe; ComponentLink13Description: https://datasheet.ciiva.com/17215/aoa0000ce1-17215388.pdf?src-supplier=Avnet+Europe; ComponentLink14URL: https://datasheet.ciiva.com/30199/4aoa0000ce1-30199822.pdf?src-supplier=Onlinecomponents.com; ComponentLink14Description: https://datasheet.ciiva.com/30199/4aoa0000ce1-30199822.pdf?src-supplier=Onlinecomponents.com
RE1 = RELAY-SPDT: RELAY GEN PURPOSE SPDT 20A 12V; Manufacturer 1: TE Connectivity P&B; Manufacturer Part Number 1: T9GV5L14-12; Coil Type: Non-Latching; Operate Time: 15ms; Release Time: 22ms; Relay Type: General Purpose; Coil Current: 75mA; Coil Power: 900mW; Coil Resistance: 160R; Supplier 1: Digi-Key; Supplier Part Number 1: PB2355-ND; RoHS 1: No; Stock 1: 1403; Pricing 1: 1 = 4.10000, 10 = 3.84800, 25 = 3.42000, 50 = 3.24900, 100 = 3.07800, 250 = 2.73600, 500 = 2.56500, 1000 = 2.39400, 5000 = 2.30850 (USD); Mount: Through Hole; Contact Material: Tin,Silver; Min Operating Temperature: -40°C; Max Operating Temperature: 105°C; Throw Configuration: SPDT; Packaging: Bulk; Coil Voltage (DC): 12V; Contact Current Rating: 20A; Termination: PC Pin; ComponentLink1URL: https://www.te.com/commerce/DocumentDelivery/DDEController?Action=srchrtrv&amp;DocNm=T9G_1216&amp;DocType=DS&amp;DocLang=English&src-supplier=Digi-Key; ComponentLink1Description: https://www.te.com/commerce/DocumentDelivery/DDEController?Action=srchrtrv&amp;DocNm=T9G_1216&amp;DocType=DS&amp;DocLang=English&src-supplier=Digi-Key
TP1-TP4 TP6-TP11 = TP: Test Point; Manufacturer 1: N/A